# Altium schematic sheet edge_dff.SchDoc
size A4
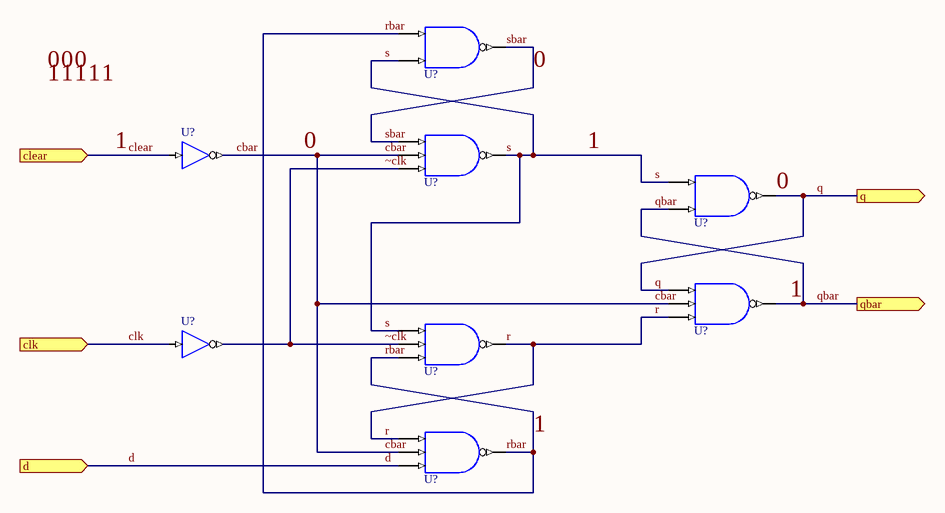
[diagram p0: edge_dff.SchDoc]

## Parts
(Parts that share a designator on the sheet are numbered #1, #2 ... from top to bottom, then left to right.)
U?#1  AND 2  (value not drawn)
U?#2  NAND_3  (value not drawn)
U?#3  BUF_inv  (value not drawn)
U?#4  AND 2  (value not drawn)
U?#5  NAND_3  (value not drawn)
U?#6  NAND_3  (value not drawn)
U?#7  BUF_inv  (value not drawn)
U?#8  NAND_3  (value not drawn)

## Ports
clear (in), clk (in), d (in), q (out), qbar (out)

## Nets
0: U?#1.Y U?#2.A U?#2.B U?#3.O U?#4.Y U?#5.A U?#5.B U?#8.B ; port q  [also labelled cbar, q, sbar]
1: U?#1.A U?#1.B U?#2.Y U?#3.I U?#4.A U?#4.B U?#5.Y U?#6.A U?#6.C U?#8.Y ; port clear, port qbar  [also labelled clear, qbar, rbar, s]
clk: U?#7.I ; port clk
d: U?#8.C ; port d
r: U?#5.C U?#6.Y U?#8.A
~clk: U?#2.C U?#6.B U?#7.O

## Notes on the sheet
- Labels drawn without touching a wire or pin: 0, 1

## Library data of the parts
U?#1 U?#4 = AND_2: 2 Input AND
U?#2 U?#5 U?#6 U?#8 = NAND_3: 3 Input NAND 1 Not
U?#3 U?#7 = BUF_inv: 1-bit General Purpose (Non-inverting) Buffer